# EAGLE design StickIt-Audio (EAGLE 5.11)
AUTHOR: Dave Vandenbout / XESS Corp.; DIGIKEY#: 399-3482-1-ND; MANF: Kemet; MANF#: C0603C475K9PACTU; MOUSER#: 80-C0603C475K9P; VERSION#: 1.0
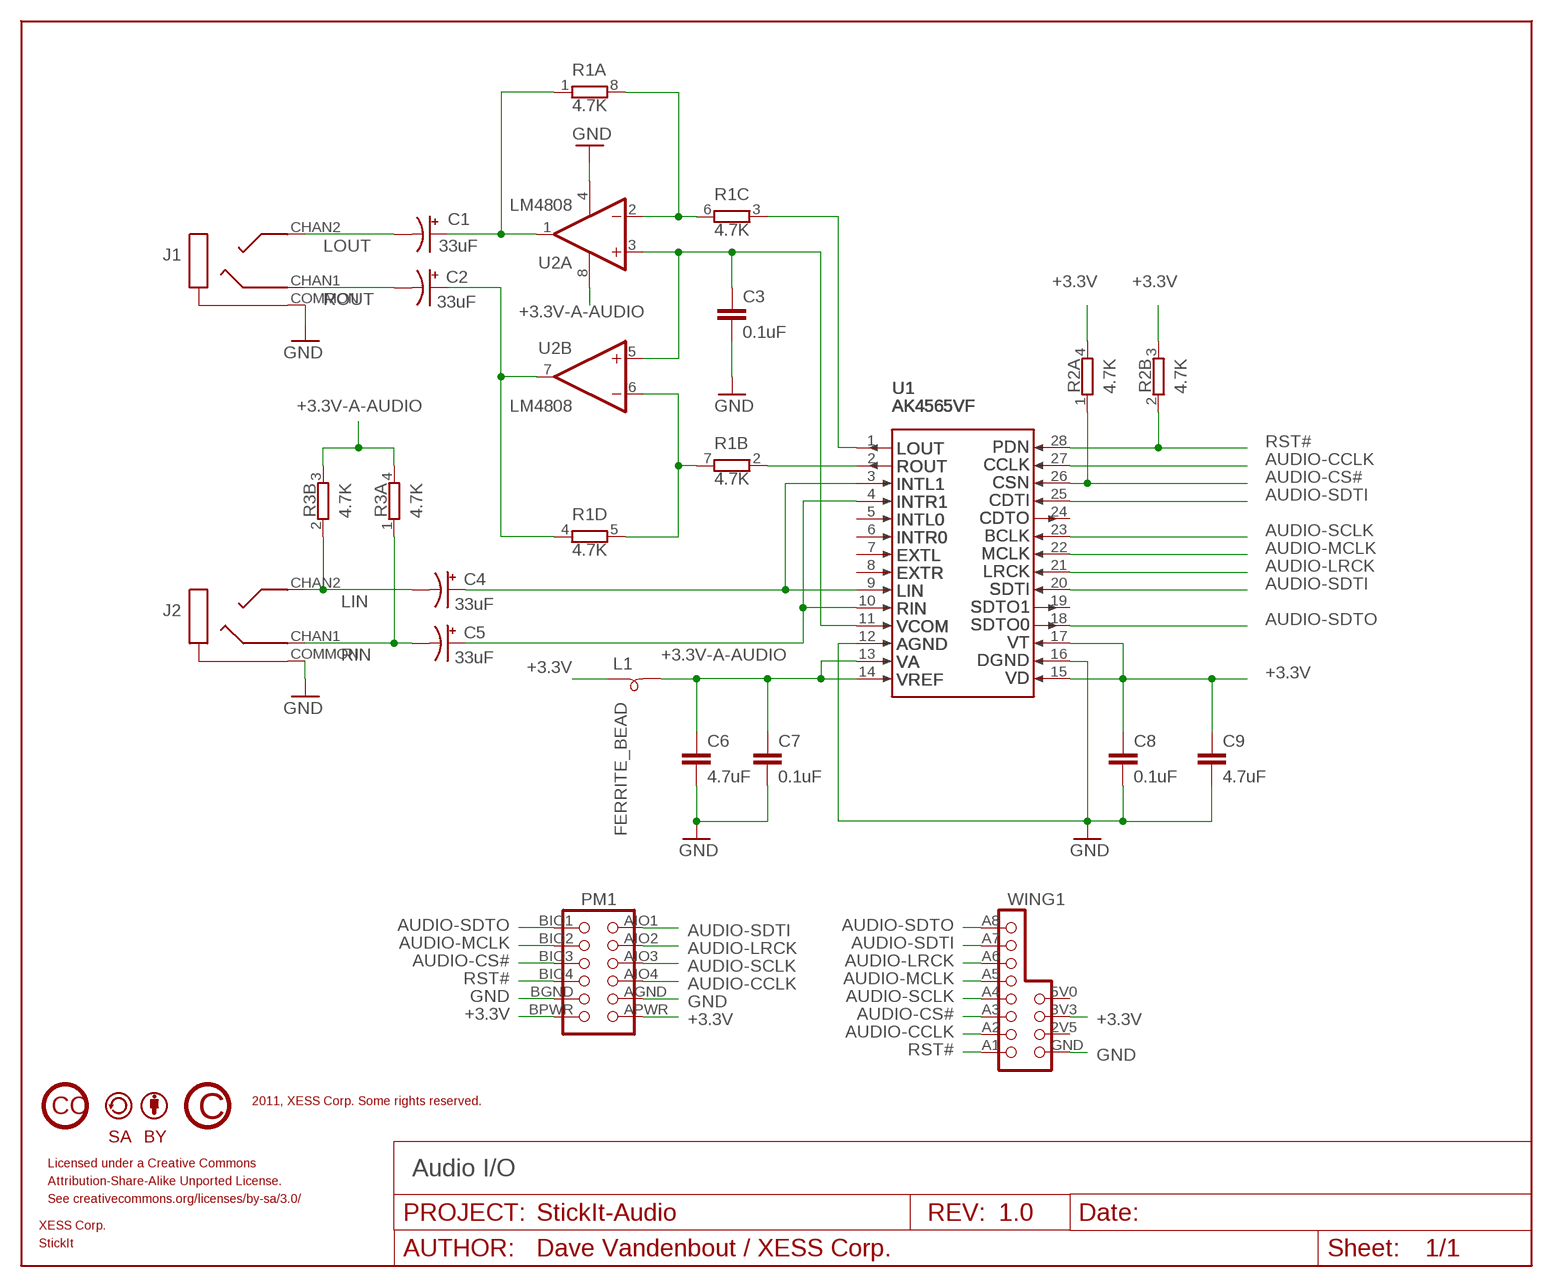
[diagram p0: schematic, sheet 1]

## Parts
C1  33uF  CPOL-USC  [PANASONIC_C]
C2  33uF  CPOL-USC  [PANASONIC_C]
C3  0.1uF  C-EUC0603  [C0603]
C4  33uF  CPOL-USC  [PANASONIC_C]
C5  33uF  CPOL-USC  [PANASONIC_C]
C6  4.7uF  C-EUC0603  [C0603]
C7  0.1uF  C-EUC0603  [C0603]
C8  0.1uF  C-EUC0603  [C0603]
C9  4.7uF  C-EUC0603  [C0603]
J1  STEREO-JACKKYCON-STX-3000  [KYCON-STX-3000]
J2  STEREO-JACKKYCON-STX-3000  [KYCON-STX-3000]
L1  FERRITE_BEAD  [C0805]
PM1  PMOD12HEADER  [PMOD12-HEADER]
R1  4.7K  RES4742  [742C083]
R2  4.7K  RES2742  [742C043]
R3  4.7K  RES2742  [742C043]
U1  AK4565VF  [AKM-VSOP28]
U2  LM4808  [MSOP8]
U$1  CC_CC  [CC_CC]
U$2  CC_SA  [CC_SA]
U$3  CC_BY  [CC_BY]
U$4  CC_COPYRIGHT  [CC_COPYRIGHT]
U$5  LOGO-STICKIT1150X350  [LOGO-STICKIT-1150X350]
U$6  LOGO-XESS900X250  [LOGO-XESS-900X250]
WING1  PAPILIO_WING8HEADER  [PAPILIO_WING8_HEADER]

## Nets
+3.3V: C8.1 C9.1 L1.1 PM1.APWR PM1.BPWR R2.3 R2.4 U1.15 U1.17 WING1.3V3
+3.3V-A-AUDIO [power]: C6.1 C7.1 L1.2 R3.3 R3.4 U1.13 U1.14 U2.8(A:V+)
AUDIO-CCLK: PM1.AIO4 U1.27 WING1.A2
AUDIO-CS#: PM1.BIO3 R2.1 U1.26 WING1.A3
AUDIO-LRCK: PM1.AIO2 U1.21 WING1.A6
AUDIO-MCLK: PM1.BIO2 U1.22 WING1.A5
AUDIO-SCLK: PM1.AIO3 U1.23 WING1.A4
AUDIO-SDTI: PM1.AIO1 U1.20 U1.25 WING1.A7
AUDIO-SDTO: PM1.BIO1 U1.18 WING1.A8
GND: C3.2 C6.2 C7.2 C8.2 C9.2 J1.COMMON J2.COMMON PM1.AGND PM1.BGND U1.12 U1.16 U2.4(A:V-) WING1.GND
LIN: C4.- J2.CHAN2 R3.2
LOUT: C1.- J1.CHAN2
N$2: C3.1 U1.11 U2.3(A:+IN) U2.5(B:+IN)
N$3: C1.+ R1.1 U2.1(A:OUT)
N$4: C2.+ R1.4 U2.7(B:OUT)
N$5: R1.6 R1.8 U2.2(A:-IN)
N$6: R1.5 R1.7 U2.6(B:-IN)
N$7: R1.2 U1.2
N$8: C4.+ U1.3 U1.9
N$9: R1.3 U1.1
N$14: C5.+ U1.4 U1.10
RIN: C5.- J2.CHAN1 R3.1
ROUT: C2.- J1.CHAN1
RST#: PM1.BIO4 R2.2 U1.28 WING1.A1
Unconnected: U1.5 U1.6 U1.7 U1.8 U1.19 U1.24 WING1.2V5 WING1.5V0(5V)

## Notes on the sheet
- #3
- #5 | #4
- #3
- #7
- #6
- #3
- #3
- #2
- #1
- 2011, XESS Corp. Some rights reserved.
- Licensed under a Creative Commons
- Audio I/O
- Attribution-Share-Alike Unported License.
- See creativecommons.org/licenses/by-sa/3.0/

## Library data of the parts
C1 C2 C4 C5 = rcl:CPOL-US: POLARIZED CAPACITOR, American symbol
C3 C6-C9 = rcl:C-EU: CAPACITOR, European symbol
J1 J2 = xess:STEREO-JACK: Stereo Audio Jack; MANF: Kycon; MANF#: STX-3000; MOUSER#: 806-STX-3000
L1 = xess:FERRITE_BEAD
PM1 = xess:PMOD12: 12-Pin PMOD Socket/Header 8 data I/O pins, 2 GND, 2 PWR.
R1 = xess:RES4: Resistor 4-pack Package of four resistors.; DIGIKEY#: 742C083???JPCT-ND; MANF: CTS Resistor Products; MANF#: 742C083???JPTR; MOUSER#: 774-742C083???JP
R2 R3 = xess:RES2: Resistor 2-pack Package of two resistors.; DIGIKEY#: 742C043???JPCT-ND; MANF: CTS Resistor Products; MANF#: 742C043???JPTR; MOUSER#: 774-742C043???JP
U1 = xess:AK4565VF: AKM 20-bit Audio Codec; MANF: AKM; MANF#: AK4565VF
U2 = xess:LM4808: LM4808 Dual Headphone Amp
U$1 = xess:CC_CC
U$2 = xess:CC_SA
U$3 = xess:CC_BY
U$4 = xess:CC_COPYRIGHT
U$5 = xess:LOGO-STICKIT
U$6 = xess:LOGO-XESS
WING1 = xess:PAPILIO_WING8: PIN HEADER

## Net classes
1 power: clearance 0.254 mm

## Board
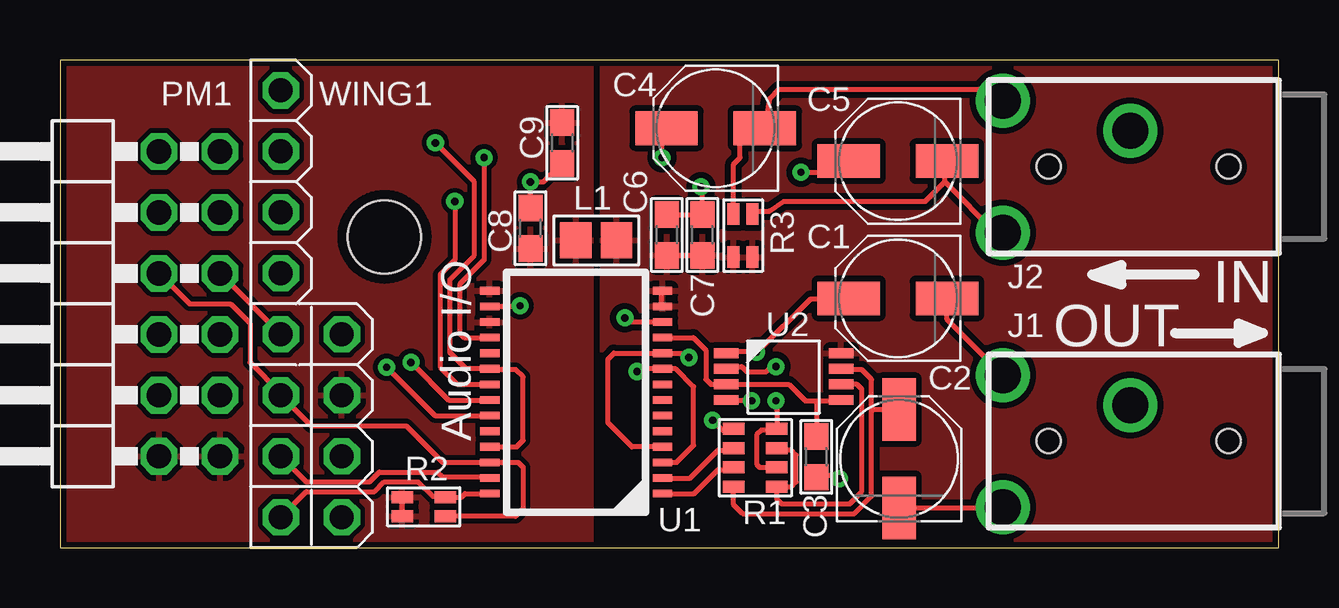
[diagram p1: board, top side]
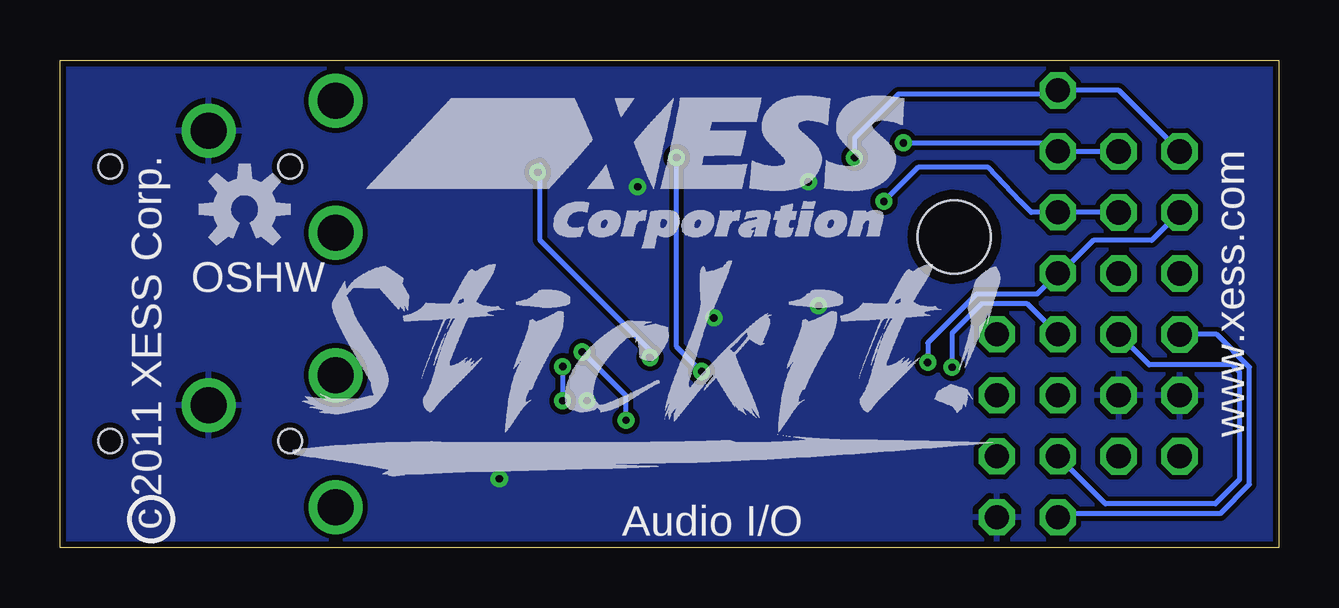
[diagram p2: board, bottom side, seen from below]

Size 50.8 x 20.32 mm. Coordinates in mm from the lower left corner, seen from the top.
Outline: 0,0 50.8,0 50.8,20.32 0,20.32 0,0
Copper layers (1*16): Top 0.035mm / dielectric 1.5mm / Bottom 0.035mm
Design rules "ITeadstudio_safe *": minimum track width 8mil, minimum drill 12mil, track to track 8mil, track to pad 8mil, pad to pad 8mil, via to via 8mil, smd to smd 0mil, copper to edge 10mil, drill to drill 10mil, minimum pad ring 10mil, minimum via ring 8mil, stop-mask expansion 2mil, vias tented up to drill 100mil, thermal gap 10mil

### Footprints (pad centres in the part's own frame; a part is rotated, then mirrored left to right if it is on the bottom)
PANASONIC_C = smd 2.6 x 1.4: + 2.05,0; - -2.05,0
C0603 = smd 1.1 x 1: 1 -0.85,0; 2 0.85,0
KYCON-STX-3000 = drill 1.5 round: CHAN1 13.4,2.75; CHAN2 13.4,-2.75; COMMON 8.1,-1.5 | hole 1: 4,0; 11.5,0
C0805 = smd 1.3 x 1.5: 1 -0.85,0; 2 0.85,0
PMOD12-HEADER = drill 1.016 octagon: AGND -3.81,-6.35; AIO1 6.35,-6.35; AIO2 3.81,-6.35; AIO3 1.27,-6.35; AIO4 -1.27,-6.35; APWR -6.35,-6.35; BGND -3.81,-3.81; BIO1 6.35,-3.81; BIO2 3.81,-3.81; BIO3 1.27,-3.81; BIO4 -1.27,-3.81; BPWR -6.35,-3.81
742C083 = smd 0.5 x 0.9: 1 -0.4,-0.9; 2 0.4,-0.9; 3 1.2,-0.9; 4 2,-0.9; 5 2,0.9; 6 1.2,0.9; 7 0.4,0.9; 8 -0.4,0.9
742C043 = smd 0.5 x 0.9: 1 -0.4,-0.9; 2 0.4,-0.9; 3 0.4,0.9; 4 -0.4,0.9
AKM-VSOP28 = smd 0.8 x 0.32: 1 -0.05,0; 2 -0.05,-0.65; 3 -0.05,-1.3; 4 -0.05,-1.95; 5 -0.05,-2.6; 6 -0.05,-3.25; 7 -0.05,-3.9; 8 -0.05,-4.55; 9 -0.05,-5.2; 10 -0.05,-5.85; 11 -0.05,-6.5; 12 -0.05,-7.15; 13 -0.05,-7.8; 14 -0.05,-8.45; 15 7.15,-8.45; 16 7.15,-7.8; 17 7.15,-7.15; 18 7.15,-6.5; 19 7.15,-5.85; 20 7.15,-5.2; 21 7.15,-4.55; 22 7.15,-3.9; 23 7.15,-3.25; 24 7.15,-2.6; 25 7.15,-1.95; 26 7.15,-1.3; 27 7.15,-0.65; 28 7.15,0
MSOP8 = smd 0.41 x 1.02: 1 0,0; 2 0.65,0; 3 1.3,0; 4 1.95,0; 5 1.95,4.8; 6 1.3,4.8; 7 0.65,4.8; 8 0,4.8
PAPILIO_WING8_HEADER = drill 1 octagon: 2V5 -2.54,-2.54; 3V3 -2.54,-5.08; 5V0 -2.54,-7.62; A1 0,0; A2 0,-2.54; A3 0,-5.08; A4 0,-7.62; A5 0,-10.16; A6 0,-12.7; A7 0,-15.24; A8 0,-17.78; GND -2.54,0 | hole 3.048: -4.318,-11.684

### Placement (x,y rotation side)
C1  34.92,10.39 180 top
C2  34.98,3.71 90 top
C3  31.52,3.78 270 top
C4  27.33,17.48 180 top
C5  34.92,16.1 180 top
C6  25.3,13.03 90 top
C7  26.77,13.03 90 top
C8  19.61,13.31 90 top
C9  20.93,16.87 270 top
J1  52.7,4.45 180 top
J2  52.7,15.88 180 top
L1  22.35,12.8 0 top
PM1  0.32,10.16 90 top
R1  28.98,4.55 270 top
R2  15.16,1.7 90 top
R3  28.47,13 180 top
U1  25.07,2.25 180 top
U2  27.76,8.1 270 top
U$1  -5.08,-12.7 0 top  (outside the outline)
U$2  0.64,-12.7 0 top  (outside the outline)
U$3  5.08,-12.7 0 top  (outside the outline)
U$4  -5.08,-5.08 0 top  (outside the outline)
U$5  41.05,4.06 0 bottom
U$6  38,14.83 0 bottom
WING1  9.21,1.27 180 top

### Tracks (layer width: path | path; a pad name or v marks a point on that pad's centre or on a via)
+3.3V
  Top 0.203: R2.3 R2.4
  pour Top: 0,20.32 0,0 22.15,0 22.15,20.32
+3.3V-A-AUDIO
  Top 0.203: 25.07,10.05 25.07,10.7 | C6.1 C7.1
  pour Top (rank 2): 0,20.32 0,0 50.8,0 50.8,20.32
AUDIO-CCLK
  Top 0.203: WING1.A2 9.21,3.8 10.26,2.74 12.9,2.74 13.31,3.15 15.75,3.15 15.95,2.95 17.87,2.95 U1.27
  Bottom 0.203: PM1.AIO4 5.4,7.62 1.93,7.62 1.63,7.32 1.63,2.85 2.64,1.83 7.23,1.83 WING1.A2
AUDIO-CS#
  Top 0.203: R2.1 18.98,1.3 19.3,1.63 19.3,3.35 19.1,3.56 19.1,3.55 U1.26 15.96,3.55 14.43,5.08 10.48,5.08 WING1.A3 9.21,6.44 7.92,7.72 7.92,9.35 7.11,10.16 5.4,10.16 PM1.BIO3
AUDIO-LRCK  (via drill 0.3)
  Top 0.203: v16.46,14.43 16.46,11.99 15.85,11.38 15.85,7.52 16.57,6.8 U1.21
  Bottom 0.203: v16.46,14.43 15.04,15.85 12.1,15.85 10.77,14.43 10.31,13.97 WING1.A6 PM1.AIO2
AUDIO-MCLK  (via drill 0.3)
  Top 0.203: U1.22 16.2,6.15 v14.63,7.72
  Bottom 0.203: PM1.BIO2 5.3,12.8 7.72,12.8 9.09,11.43 WING1.A5 10.07,10.57 12.6,10.57 14.63,8.53 v14.63,7.72
AUDIO-SCLK  (via drill 0.3)
  Top 0.203: PM1.AIO3 WING1.A4 | U1.23 15.63,5.5 v13.61,7.52
  Bottom 0.203: v13.61,7.52 13.61,8.94 12.39,10.16 10.48,10.16 WING1.A4
AUDIO-SDTI  (via drill 0.3)
  Top 0.203: v15.65,16.87 17.27,15.24 17.27,12.19 16.26,11.18 16.26,8.13 16.93,7.45 U1.20 17.95,7.42 19,7.42 19.3,7.11 19.3,4.47 19.04,4.2 U1.25
  Bottom 0.203: v15.65,16.87 9.46,16.87 WING1.A7 PM1.AIO1
AUDIO-SDTO  (via drill 0.3)
  Top 0.203: U1.18 16.85,8.75 16.66,8.94 16.66,10.97 17.68,11.99 v17.68,16.26
  Bottom 0.203: PM1.BIO1 6.67,19.05 WING1.A8 9.36,18.9 15.85,18.9 17.68,17.07 v17.68,16.26
GND  (via drill 0.3)
  Top 0.203: 19.41,10.05 v19.18,10.08 19.14,10.05 U1.16 | C3.2 31.27,3.07 31.32,3.02 32.13,3.02 v32.49,2.87 | U2.4 28.8,6.15 v28.83,6.12 | C6.2 C7.2 26.77,14.99 v26.72,15.04 | C8.2 v19.61,15.24 20.15,15.24 C9.2 | U1.12 23.72,9.4 v23.55,9.58
  pour Bottom (rank 2): 50.8,0 0,0 0,20.32 50.8,20.32
LIN
  Top 0.203: J2.CHAN2 38.83,19.1 29.97,19.1 29.58,18.71 C4.- 28.97,17.07 28.55,17.07 28.35,16.87 28.35,16.26 28.07,15.98 R3.2
LOUT
  Top 0.203: C1.- 36.98,9.53 J1.CHAN2
N$2
  Top 0.203: 31.47,6.12 32.53,6.12 U2.5 | 31.47,6.12 31.06,6.12 30.38,6.8 U2.3 27.13,6.81 26.92,7.01 26.92,8.23 26.4,8.75 U1.11 | C3.1 31.52,6.07 31.47,6.12
N$3  (via drill 0.3)
  Top 0.203: U2.1 27.81,8.15 v29.03,8.15 29.08,8.15 31.29,10.36 32.85,10.36 C1.+ | v27.2,5.31 27.61,4.9 28.04,4.9 R1.1
  Bottom 0.203: v27.2,5.31 27.2,6.33 v29.03,8.15
N$4
  Top 0.203: R1.4 28.08,1.79 28.45,1.42 33.12,1.42 33.83,2.13 33.83,5.69 | 33.83,5.69 33.83,7.01 33.43,7.42 32.6,7.42 U2.7 | C2.+ 33.9,5.76 33.83,5.69
N$5  (via drill 0.3)
  Top 0.203: v29.84,6.12 29.88,5.75 R1.8 29.84,4.9 29.23,4.9 29.03,4.7 29.03,3.48 29.16,3.35 R1.6 | v29.84,7.54 29.64,7.54 29.44,7.34 28.63,7.34 28.42,7.54 27.85,7.54 U2.2
  Bottom 0.203: v29.84,7.54 v29.84,6.12
N$6
  Top 0.203: R1.7 29.96,4.06 30.48,4.06 30.68,3.86 30.68,2.74 30.49,2.55 R1.5 29.88,2.02 30.07,1.83 32.92,1.83 33.43,2.34 33.43,6.6 33.22,6.81 U2.6
N$7
  Top 0.203: R1.2 28,4.06 27.43,4.06 26.27,2.9 U1.2
N$8  (via drill 0.3)
  Top 0.203: v25.09,16.26 25.09,16.85 C4.+ | v24.05,7.34 24.16,7.45 U1.9 25.67,7.45 26.42,6.71 26.42,4.27 25.7,3.55 U1.3
  Bottom 0.203: v25.09,16.26 25.09,8.38 v24.05,7.34
N$9
  Top 0.203: R1.3 27.99,3.25 27.43,3.25 26.43,2.25 U1.1
N$14  (via drill 0.3)
  Top 0.203: v30.89,15.65 32.62,15.65 C5.+ | U1.4 23.84,4.2 22.84,5.21 22.84,7.85 23.09,8.1 U1.10 26.04,8.1 v26.21,7.92
  Bottom 0.203: v30.89,15.65 30.79,15.95 30.79,12.8 26.21,8.23 v26.21,7.92
RIN
  Top 0.203: 36.88,15.24 36.07,14.43 30.18,14.43 29.57,14.02 28.99,14.02 R3.1 | 36.88,15.24 36.88,16.01 C5.- | J2.CHAN1 39,13.12 36.88,15.24
ROUT
  Top 0.203: C2.- 38.58,1.66 J1.CHAN1
RST#
  Top 0.203: U1.28 16.88,2.25 16.73,2.1 R2.2 16.03,2.13 15.54,2.13 14.94,2.74 13.51,2.74 13.11,2.34 10.26,2.34 9.21,1.28 WING1.A1
  Bottom 0.203: PM1.BIO4 2.59,8.89 1.22,7.52 1.22,2.64 2.44,1.42 9.05,1.42 WING1.A1

### Text on the board
tPlace: IN | OUT | Audio I/O
bPlace: www.xess.com | OSHW | c 2011 XESS Corp. | Audio I/O
tDocu: 2011, XESS Corp. Some rights reserved. | Licensed under a Creative Commons | Attribution-Share-Alike Unported License. | See creativecommons.org/licenses/by-sa/3.0/